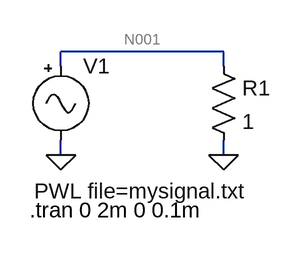
[diagram p0: schematic Draft1.asc]
Draft1.asc, the LTspice schematic file:
Version 4
SHEET 1 880 680
WIRE 176 112 0 112
WIRE 0 128 0 112
WIRE 176 128 176 112
WIRE 0 224 0 208
WIRE 176 224 176 208
FLAG 0 224 0
FLAG 176 224 0
SYMBOL res 160 112 R0
SYMATTR InstName R1
SYMATTR Value 1
SYMBOL Misc\\signal 0 112 R0
WINDOW 3 -29 151 Left 2
WINDOW 123 0 0 Left 0
WINDOW 39 0 0 Left 0
SYMATTR InstName V1
SYMATTR Value PWL file=mysignal.txt
TEXT -34 284 Left 2 !.tran 0 2m 0 0.1m

The netlist it stands for:
* Draft1.asc
R1 N001 0 1
V1 N001 0 PWL file=mysignal.txt
.tran 0 2m 0 0.1m
.backanno
.end

* Results of the author's LTspice run, read from the files saved beside the schematic
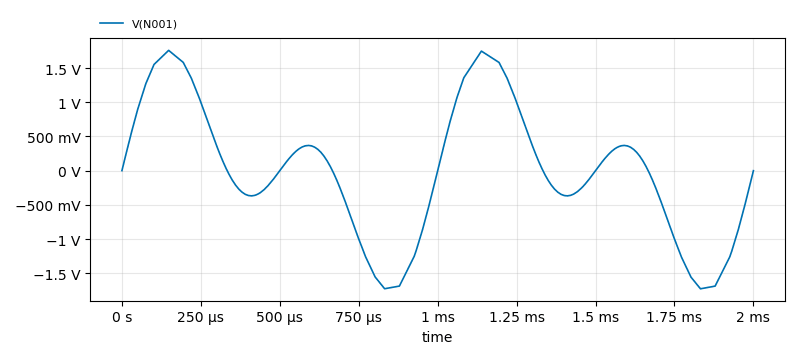
[diagram p1: Transient Analysis of Draft1.asc, plotted from the saved traces]
* Transient Analysis, 1 run:
*   V(N001): min -1.727 V, max 1.758 V, average -834.8 µV, rms 989.7 mV, last 0 V